# Altium schematic sheet Interfaces.SchDoc
size A3; DocumentNumber: 9; SheetNumber: 9; SheetTotal: 9; PageSetup: Record=PageOptions|CenterHorizontal=True|CenterVertical=True|PrintScale=0.97|XCorrection=1.00|YCorrection=1.00|PrintKind=1|BorderSize=5000000|LeftOffset=0|BottomOffset=0|Orientation=2|PaperLength=2970|PaperWidth=2100|Scale=100|PaperSource=7|PrintQuality=600|MediaType=1|DitherType=10|PaperKind=A4|PrintScaleMode=1
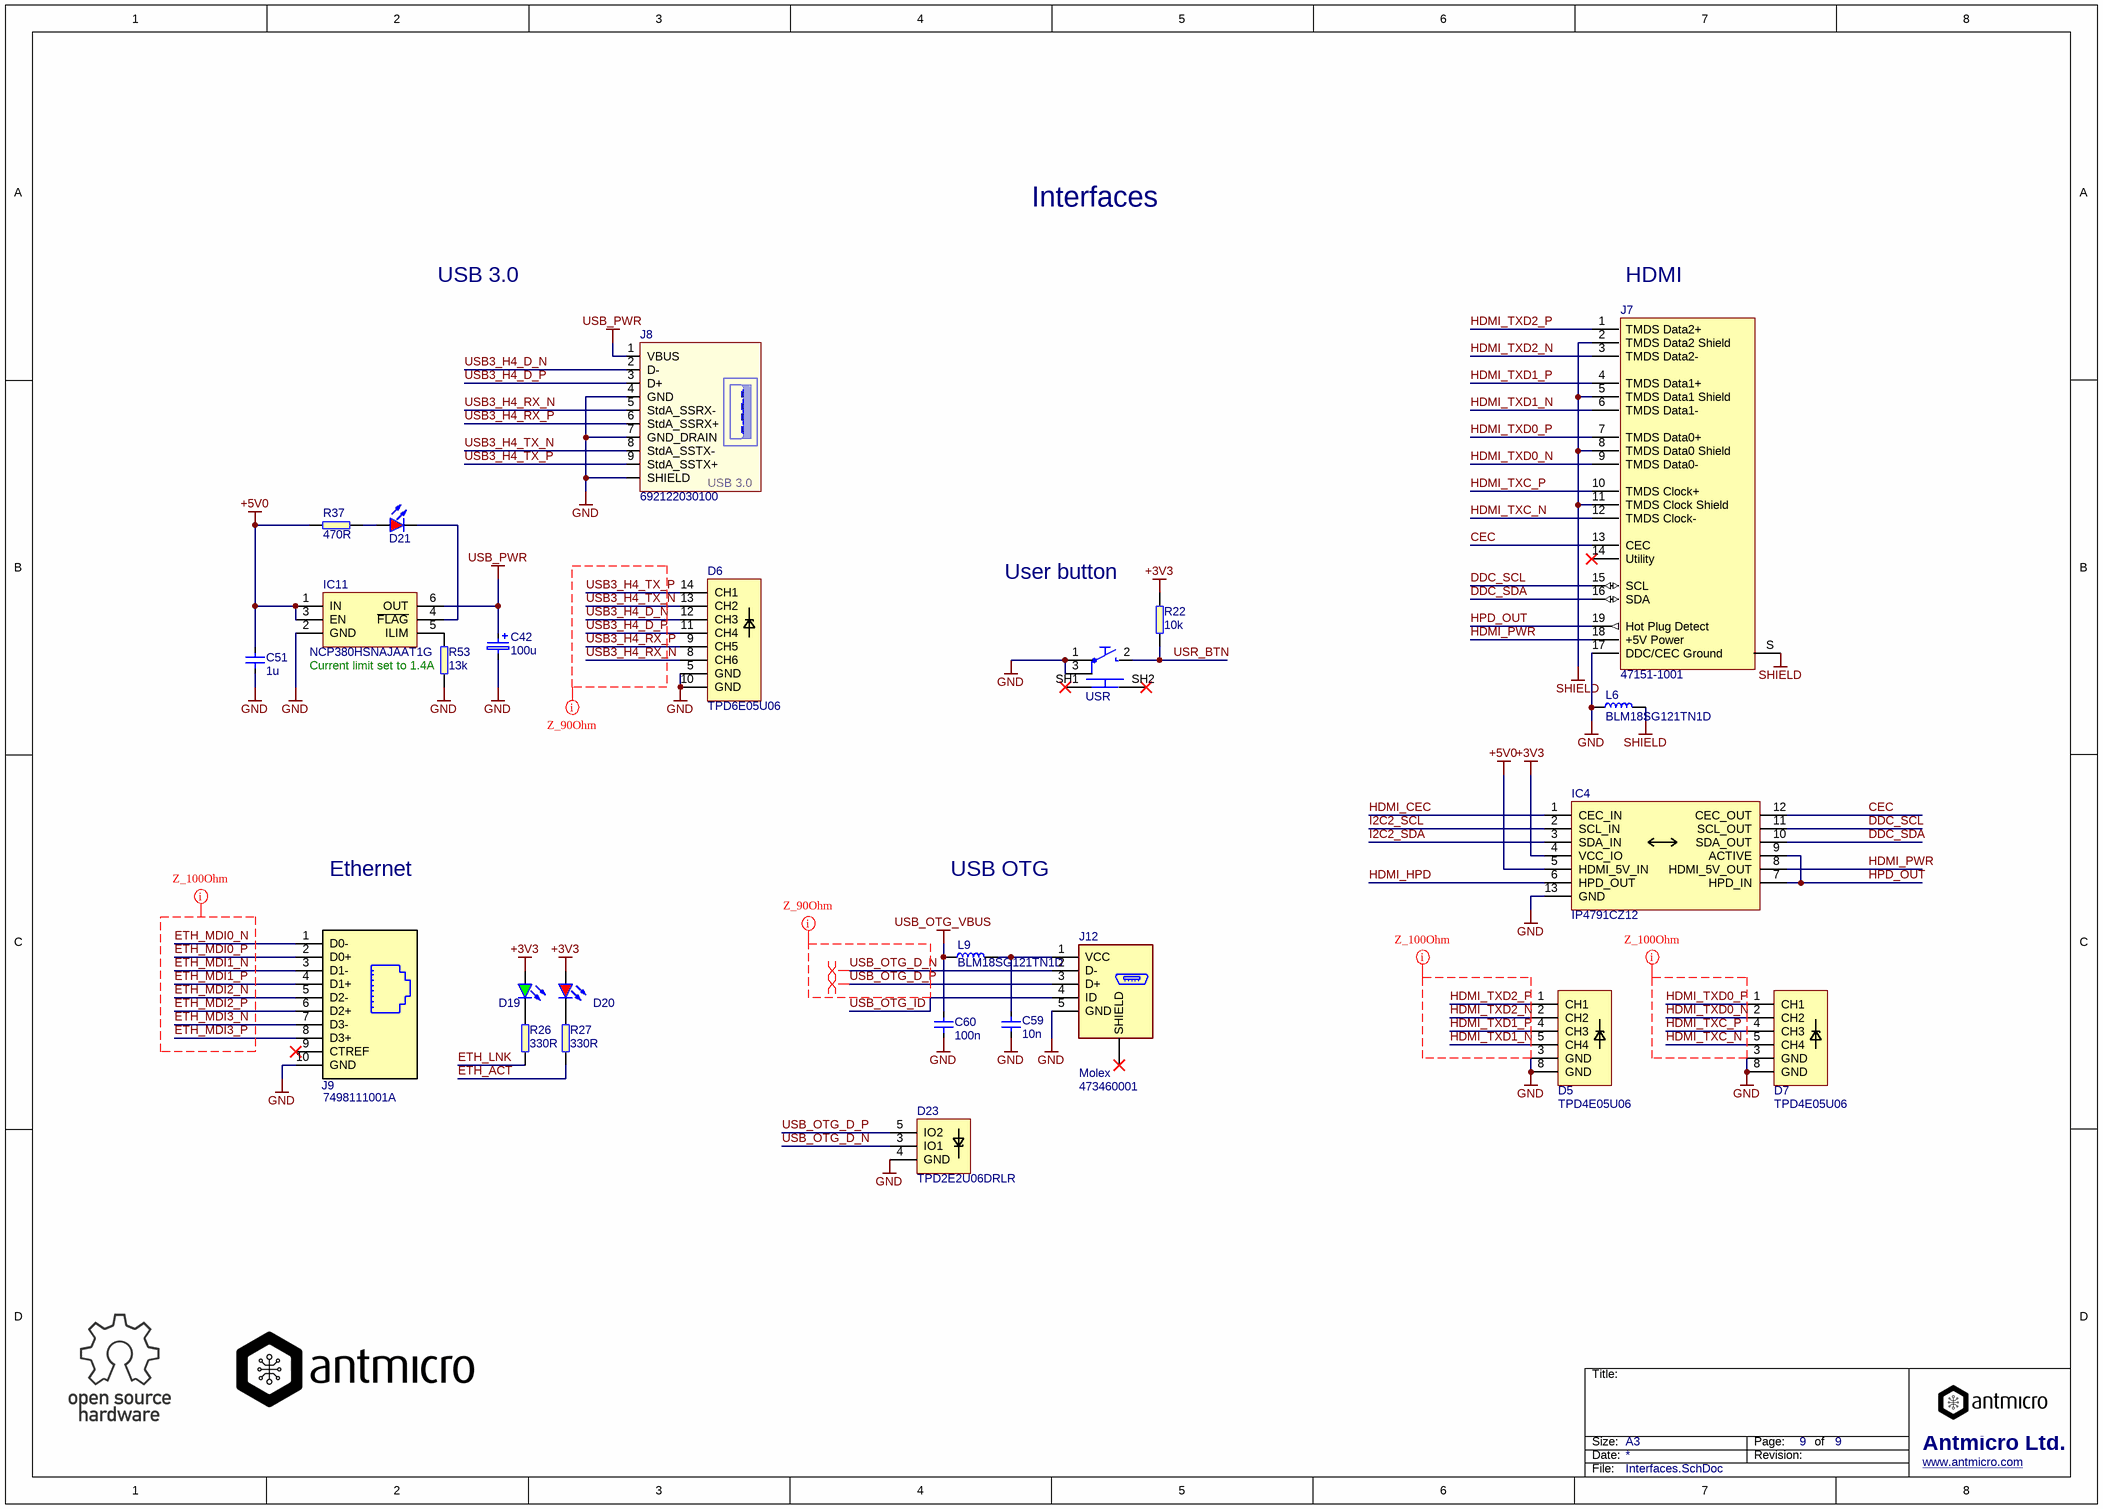
[diagram p0: Interfaces.SchDoc]

## Parts
C42  100u  [KEMET_A]
C51  1u  [0402]
C59  10n  [0402]
C60  100n  [0402]
D5  TPD4E05U06  [TPD4E05U06_PASS]
D6  TPD6E05U06  [TPD6E05U06_PASS]
D7  TPD4E05U06  [TPD4E05U06_PASS]
D19  KPJA-2107CKCK  [KPJA-2107]  (value not drawn)
D20  KPJA-2107SYCK  [KPJA-2107]  (value not drawn)
D21  KPT-1608EC  [LED0603]  (value not drawn)
D23  TPD2E2U06DRLR  [TPD2E2U06DRLR]
IC4  IP4791CZ12  [IP4791CZ12]
IC11  NCP380HSNAJAAT1G  [TSOP-6]
J7  47151-1001  [Molex_HDMI_471511001]
J8  692122030100  [692122030100]
J9  7498111001A  [7498111001A]
J12  Manufacturer: Molex  Part Symbol: 473460001  [CON-Molex-047346-0001]  (hidden comment: Molex 47346-0001)
L6  BLM18SG121TN1D  [0603]
L9  BLM18SG121TN1D  [0603]
R22  10k  [0402]
R26  330R  [0402]
R27  330R  [0402]
R37  470R  [0402]
R53  13k  [0402]
USR  TL3340AF160QG  [TL3340AF160QG]  (value not drawn)

## Nets
+3V3: D19.A D20.A IC4.4(VCC_IO) R22.2
+5V0: C51.2 IC4.5(HDMI_5V_IN) IC11.1(IN) IC11.3(EN) R37.2
GND: C42.2 C51.1 C59.2 C60.1 D5.3(GND) D5.8(GND) D6.5(GND) D6.10(GND) D7.3(GND) D7.8(GND) D23.4(GND) IC4.13(GND) IC11.2(GND) J7.17(DDC/CEC_Ground) J8.4(GND) J8.7(GND_DRAIN) J8.SHIELD J9.10(GND) J12.5(GND) L6.1 R53.1 USR.1 USR.3
SHIELD: J7.2(TMDS_Data2_Shield) J7.5(TMDS_Data1_Shield) J7.8(TMDS_Data0_Shield) J7.11(TMDS_Clock_Shield) J7.S(SH) L6.2
USB_OTG_VBUS: C60.2 L9.1
USB_PWR: C42.1 IC11.6(OUT) J8.1(VBUS)
CEC: IC4.12(CEC_OUT) J7.13(CEC)
DDC_SCL: IC4.11(SCL_OUT) J7.15(SCL)
DDC_SDA: IC4.10(SDA_OUT) J7.16(SDA)
ETH_ACT: R27.2
ETH_LNK: R26.2
ETH_MDI0_N: J9.1(D0-)
ETH_MDI0_P: J9.2(D0+)
ETH_MDI1_N: J9.3(D1-)
ETH_MDI1_P: J9.4(D1+)
ETH_MDI2_N: J9.5(D2-)
ETH_MDI2_P: J9.6(D2+)
ETH_MDI3_N: J9.7(D3-)
ETH_MDI3_P: J9.8(D3+)
HDMI_CEC: IC4.1(CEC_IN)
HDMI_HPD: IC4.6(HPD_OUT)
HDMI_PWR: IC4.8(HDMI_5V_OUT) J7.18(+5V_Power)
HDMI_TXC_N: D7.5(CH4) J7.12(TMDS_Clock-)
HDMI_TXC_P: D7.4(CH3) J7.10(TMDS_Clock+)
HDMI_TXD0_N: D7.2(CH2) J7.9(TMDS_Data0-)
HDMI_TXD0_P: D7.1(CH1) J7.7(TMDS_Data0+)
HDMI_TXD1_N: D5.5(CH4) J7.6(TMDS_Data1-)
HDMI_TXD1_P: D5.4(CH3) J7.4(TMDS_Data1+)
HDMI_TXD2_N: D5.2(CH2) J7.3(TMDS_Data2-)
HDMI_TXD2_P: D5.1(CH1) J7.1(TMDS_Data2+)
HPD_OUT: IC4.7(HPD_IN) IC4.9(ACTIVE) J7.19(Hot_Plug_Detect)
I2C2_SCL: IC4.2(SCL_IN)
I2C2_SDA: IC4.3(SDA_IN)
USB3_H4_D_N: D6.12(CH3) J8.2(D-)
USB3_H4_D_P: D6.11(CH4) J8.3(D+)
USB3_H4_RX_N: D6.8(CH6) J8.5(StdA_SSRX-)
USB3_H4_RX_P: D6.9(CH5) J8.6(StdA_SSRX+)
USB3_H4_TX_N: D6.13(CH2) J8.8(StdA_SSTX-)
USB3_H4_TX_P: D6.14(CH1) J8.9(StdA_SSTX+)
USB_OTG_D_N: D23.3(IO1) J12.2(D-)
USB_OTG_D_P: D23.5(IO2) J12.3(D+)
USB_OTG_ID: J12.4(ID)
USR_BTN: R22.1 USR.2
NetC59_1: C59.1 J12.1(VCC) L9.2
NetD19_K: D19.K R26.1
NetD20_K: D20.K R27.1
NetD21_A: D21.A R37.1
NetD21_K: D21.K IC11.4(~{FLAG})
NetIC11_5: IC11.5(ILIM) R53.2

Not connected (* = marked no-connect by the designer): J7 14(Utility)*; J9 9(CTREF)*; J12 S(SHIELD)*; USR SH1* SH2*

## Layout directives
differential pair: USB_OTG_D_N, USB_OTG_D_P
net class Z_90Ohm: USB3_H4_D_N, USB3_H4_D_P, USB3_H4_RX_N, USB3_H4_RX_P, USB3_H4_TX_N, USB3_H4_TX_P, USB_OTG_D_N, USB_OTG_D_P
net class Z_100Ohm: ETH_MDI0_N, ETH_MDI0_P, ETH_MDI1_N, ETH_MDI1_P, ETH_MDI2_N, ETH_MDI2_P, ETH_MDI3_N, ETH_MDI3_P, HDMI_TXC_N, HDMI_TXC_P, HDMI_TXD0_N, HDMI_TXD0_P, HDMI_TXD1_N, HDMI_TXD1_P, HDMI_TXD2_N, HDMI_TXD2_P

## Notes on the sheet
- Interfaces
- USB 3.0
- (near J7) HDMI
- (near R22) User button
- (near R53) Current limit set to 1.4A
- Ethernet
- USB OTG
- Title:
- Size:
- Date:
- A3
- Revision:
- Page:
- of
- Antmicro Ltd.
- File:
- www.antmicro.com
- (in symbol USB_3_A) USB 3.0

## Library data of the parts
C42 = C_100u_KEMET_A: Tantalum SMT Capacitor 100uF Case KEMET_A; Manufacturer: VISHAY; Part Symbol: 298D107X06R3A2T; Value: 100u; Part Number: C_100u_KEMET_A; MPN: 298D107X06R3A2T
C51 = C_1u_0402: MLCC SMT Capacitor 1uF 0402; Manufacturer: MULTICOMP; Part Symbol: MC0402F105Z6R3CT; Value: 1u; Part Number: C_1u_0402; MPN: MC0402F105Z6R3CT
C59 = C_10n_0402: MLCC SMT Capacitor 10 nF 0402; Manufacturer: AVX; Part Symbol: 04025G103ZAT2A; Value: 10n; Part Number: C_10n_0402; MPN: 04025G103ZAT2A
C60 = C_100n_0402: MLCC SMT Capacitor 100n 0402; Manufacturer: TDK; Part Symbol: C1005X5R0J104K050BA; Value: 100n; Part Number: C_100n_0402; MPN: C1005X5R0J104K050BA
D5 D7 = TPD4E05U06_PASS: ESD Suppressors 4-CH; Manufacturer: Texas Instruments; Part Symbol: TPD4E05U06DQAR; Part Number: TPD4E05U06_PASS; Value: TPD4E05U06; MPN: TPD4E05U06DQAR
D6 = TPD6E05U06_PASS: ESD Suppressors 6-CH Pass through layout; Manufacturer: Texas Instruments; Part Symbol: TPD6E05U06RVZR; Part Number: TPD6E05U06_PASS; Value: TPD6E05U06; MPN: TPD6E05U06RVZR
D19 = KPJA-2107CKCK: LED Green 0603 case; Part Number: LED_G; Manufacturer: KINGBRIGHT; Value: KPJA-2107CKCK; Part Symbol: KPJA-2107CKCK; MPN: KPJA-2107CKCK
D20 = KPJA-2107SYCK: LED Red 0603 case; Part Number: LED_R; Manufacturer: KINGBRIGHT; Value: KPJA-2107SYCK; Part Symbol: KPJA-2107SYCK; MPN: KPJA-2107SYCK
D21 = LED_R: LED Red 0603 case; Manufacturer: KINGBRIGHT; Part Number: LED_R; Value: KPT-1608EC; Part Symbol: KPT-1608EC; MPN: KPT-1608EC
D23 = TPD2E2U06: ESD Suppressors 2-CH; Manufacturer: Texas Instruments; Part Number: TPD2E2U06; Value: TPD2E2U06DRLR; Part Symbol: TPD2E2U06DRLR; MPN: TPD2E2U06DRLR
IC4 = IP4791CZ12: HDMI DEVICE, ESD PROTECTION; Manufacturer: NXP; Part Number: IP4791CZ12; Value: IP4791CZ12; Part Symbol: IP4791CZ12; MPN: IP4791CZ12
IC11 = NCP380HSNAJAAT1G: POWER LOAD SWITCH, HIGH SIDE; Manufacturer: ON Semiconductor; Part Symbol: NCP380HSNAJAAT1G; Value: NCP380HSNAJAAT1G; Part Number: NCP380HSNAJAAT1G; MPN: NCP380HSNAJAAT1G
J7 = CON-Molex-471511001: Header right angle HDMI; Manufacturer: MOLEX; Part Number: CON-Molex-471511001; Value: 47151-1001; Part Symbol: 47151-1001; MPN: 47151-1001
J8 = USB_3_A: USB 3.0 Type A Horizontal SMD WR-COM; Manufacturer: WURTH ELEKTRONIK; Part Number: WE-692-122-030-100; Value: 692122030100; Part Symbol: 692122030100; MPN: 692122030100
J9 = RJ-45-10: RJ-45 with Transofrmer, 10/100/1000 Base-T; Manufacturer: WURTH ELEKTRONIK; Part Number: WE-749-811-100-1A; Value: 7498111001A; Part Symbol: 7498111001A; MPN: 7498111001A
J12 = Micro USB B: USB - micro B Receptacle Connector 5 Position Surface Mount, Right Angle, Horizontal; Part Number: CON-Molex-47346-0001; Value: Molex 47346-0001; MPN: 473460001
L6 L9 = BLM18SG121TN1D: FERRITE BEAD, 0.025OHM, 3A, 0603; Manufacturer: MURATA; Part Number: BLM18SG121TN1D; Value: BLM18SG121TN1D; Part Symbol: BLM18SG121TN1D; MPN: BLM18SG121TN1D
R22 = R_10k_0402: RES, 10k, 0402; Manufacturer: MULTICOMP; Part Symbol: MCMR04X1002FTL; Value: 10k; Part Number: R_10k_0402; MPN: MCMR04X1002FTL
R26 R27 = R_330R_0402: RES, 330R, 0402; Manufacturer: MULTICOMP; Part Symbol: MCMR04X3300FTL; Value: 330R; Part Number: R_330R_0402; MPN: MCMR04X3300FTL
R37 = R_470R_0402: RES, 470R, 0402; Manufacturer: VISHAY; Part Symbol: CRCW0402470RFKED.; Value: 470R; Part Number: R_470R_0402; MPN: CRCW0402470RFKED.
R53 = R_13k_0402: RES, 13k, 0402; Manufacturer: Panasonic; Part Symbol: ERJ2GEJ133X; Value: 13k; Part Number: R_13k_0402; MPN: ERJ2GEJ133X
USR = TL3340AF160QG: E-SWITCH  TL3340AF160QG  SWITCH, TACTILE SPST 50mA, SMD GULL WING; Part Number: TL3340AF160QG; Value: TL3340AF160QG; Manufacturer: E-SWITCH; Part Symbol: TL3340AF160QG; MPN: TL3340AF160QG